# Altium project FLATSAT BCR.PrjPcb
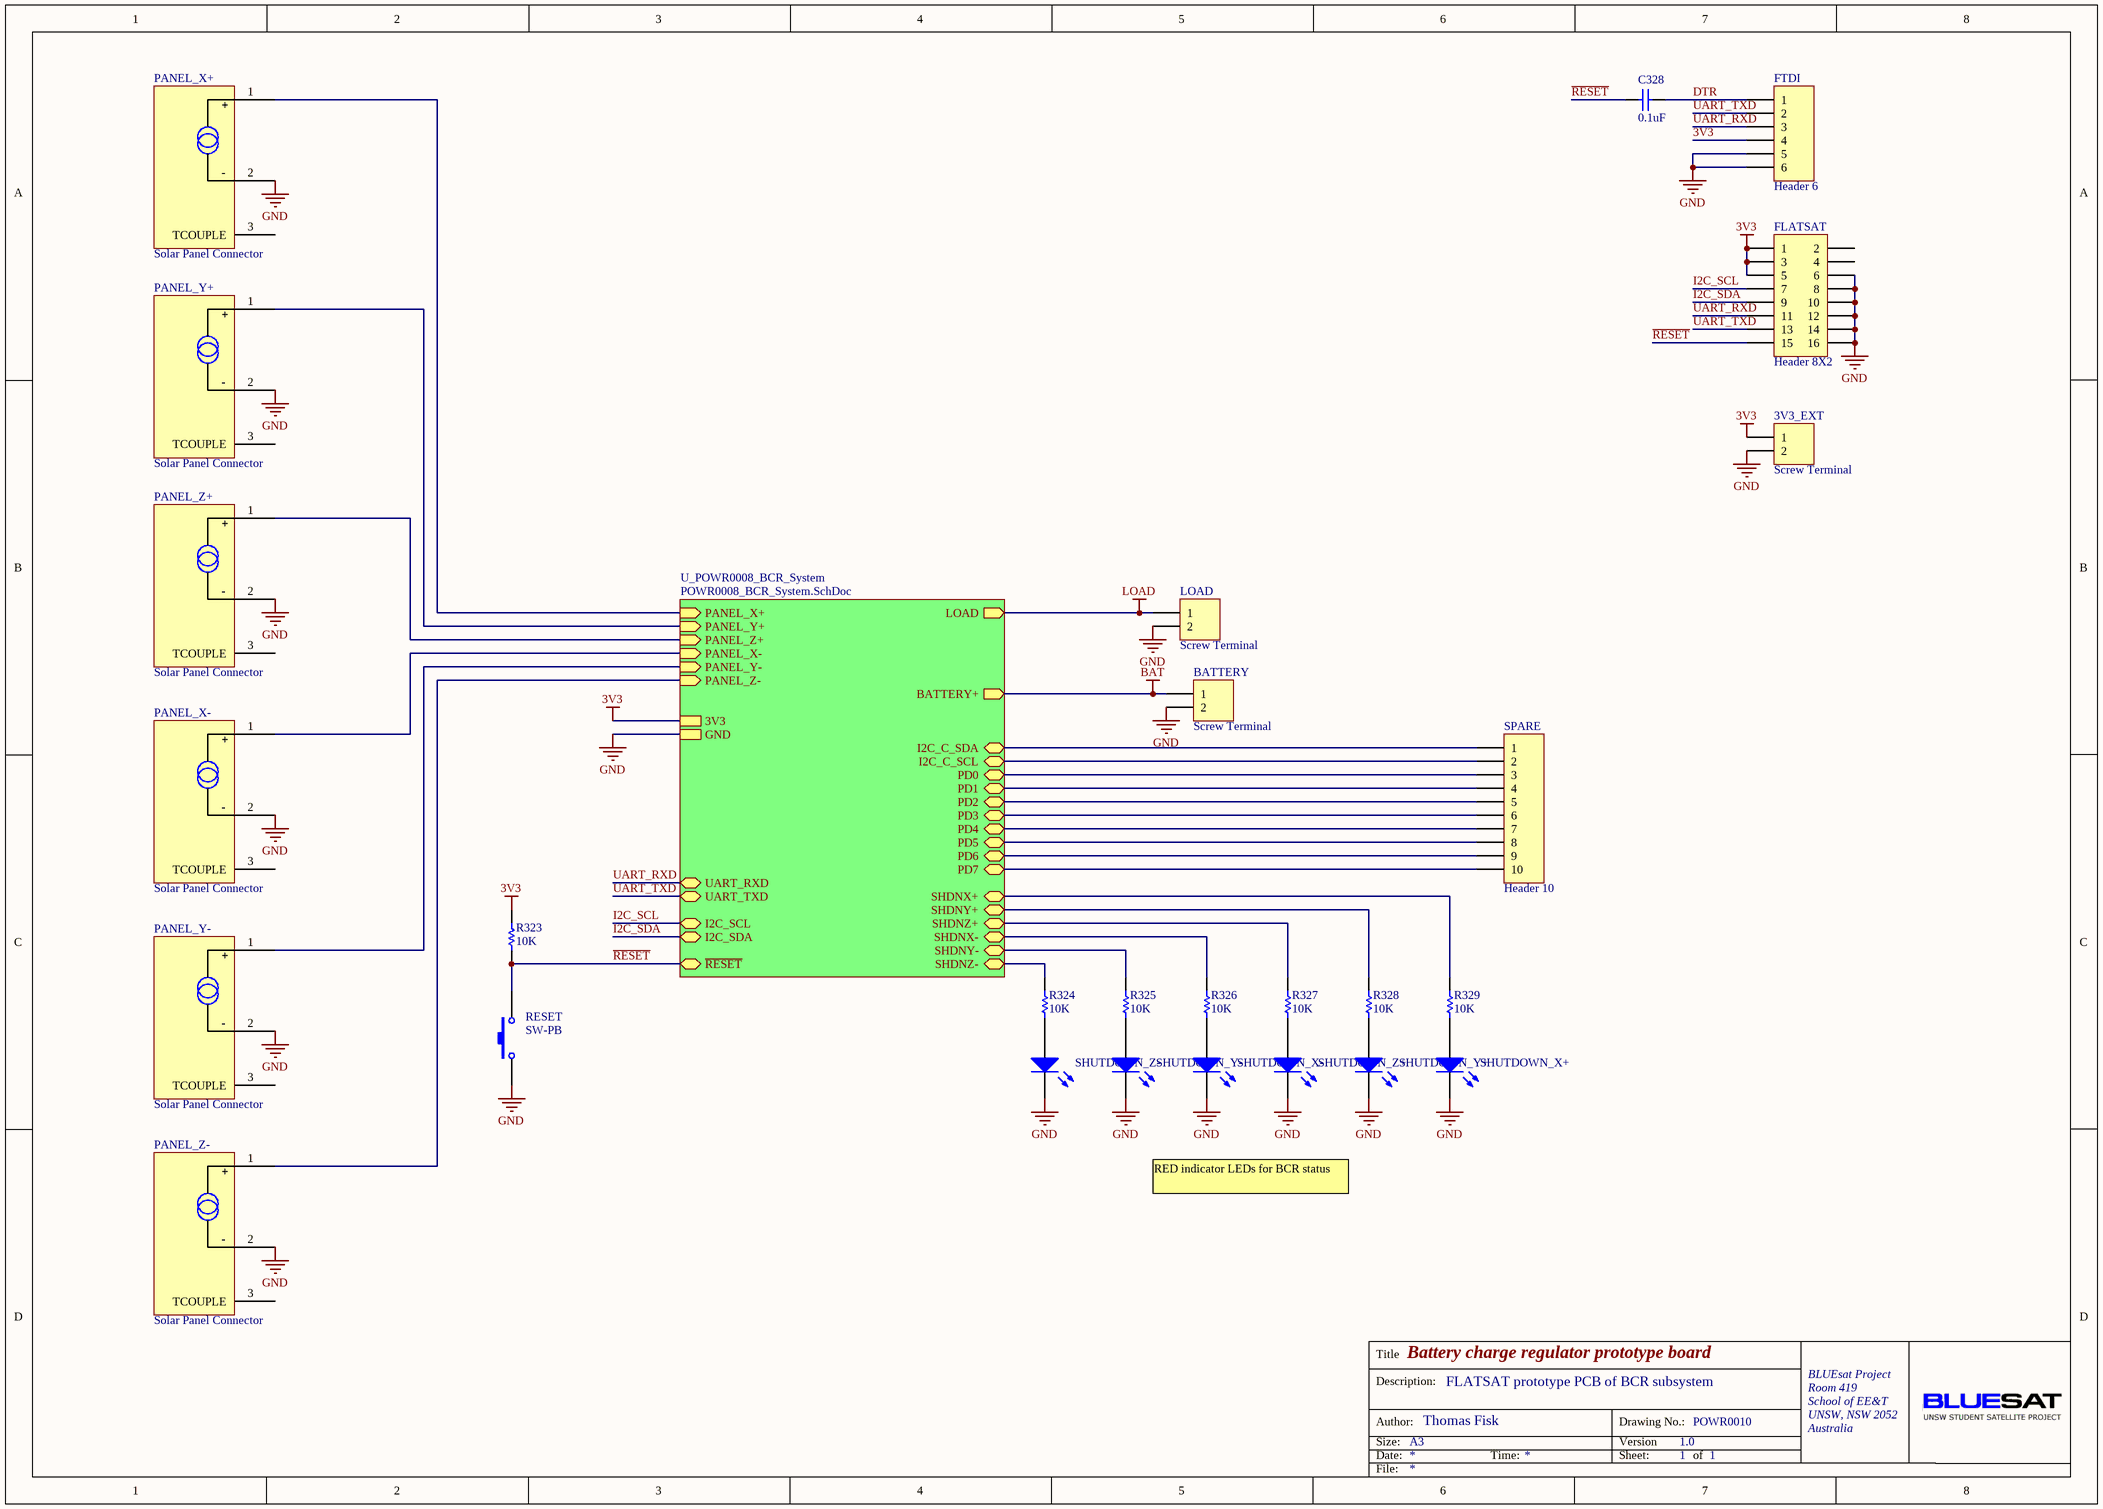
[diagram p0: POWR0010_BCR_TESTBOARD.SchDoc]
3 sheets, 174 parts. Net scope: strictly hierarchical (ports join the sheet entries above them; power ports are local).
Board file: POWR0011_BCR_PROTOTYPE.PcbDoc
Sheets:
  POWR0010_BCR_TESTBOARD.SchDoc
    U_POWR0008_BCR_System = POWR0008_BCR_System.SchDoc
      X+ = POWR0001_BCR_LT1513.SchDoc
      Y+ = POWR0001_BCR_LT1513.SchDoc
      Z+ = POWR0001_BCR_LT1513.SchDoc
      X- = POWR0001_BCR_LT1513.SchDoc
      Y- = POWR0001_BCR_LT1513.SchDoc

## Sheet POWR0010_BCR_TESTBOARD.SchDoc: Battery charge regulator prototype board
size A3; Author: T. FISK; Engineer: Thomas Fisk; Organization: BLUEsat Project; Address1: Room 419; Address2: School of EE&T; Address3: UNSW, NSW 2052; Address4: Australia; DocumentNumber: POWR0010; SheetNumber: 1; SheetTotal: 1; Description: FLATSAT prototype PCB of BCR subsystem; Version: 1.0; PageSetup: Record=PageOptions|CenterHorizontal=True|CenterVertical=True|PrintScale=0.71|XCorrection=1.00|YCorrection=1.00|PrintKind=1|BorderSize=5000000|LeftOffset=0|BottomOffset=0|Orientation=2|PaperLength=1000|PaperWidth=1000|Scale=100|PaperSource=7|PrintQuality=1200|MediaType=1|DitherType=10|PaperKind=A4|PrintScaleMode=1

### Parts
(Parts that share a designator on the sheet are numbered #1, #2 ... from top to bottom, then left to right.)
3V3_EXT  Screw Terminal  [SCREW2]
BATTERY  Screw Terminal  [SCREW2]
C328#1  value 0.1uF  [CAPC2012M]  (hidden comment: Cap)
FLATSAT  Header 8X2  [HDR2X8]
FTDI  Header 6  [HDR1X6]
LOAD  Screw Terminal  [SCREW2]
PANEL_X+  Solar Panel Connector  [SCREW2]
PANEL_X-  Solar Panel Connector  [SCREW2]
PANEL_Y+  Solar Panel Connector  [SCREW2]
PANEL_Y-  Solar Panel Connector  [SCREW2]
PANEL_Z+  Solar Panel Connector  [SCREW2]
PANEL_Z-  Solar Panel Connector  [SCREW2]
R323  value 10K  [RESC2012M]  (hidden comment: Res1)
R324  value 10K  [RESC2012M]  (hidden comment: Res1)
R325  value 10K  [RESC2012M]  (hidden comment: Res1)
R326  value 10K  [RESC2012M]  (hidden comment: Res1)
R327  value 10K  [RESC2012M]  (hidden comment: Res1)
R328  value 10K  [RESC2012M]  (hidden comment: Res1)
R329  value 10K  [RESC2012M]  (hidden comment: Res1)
RESET  SW-PB  [RESET SWITCH]
SHUTDOWN_X+  8V0_RX2  [6-0805_M]  (value not drawn)
SHUTDOWN_X-  VVAR_TX1  [6-0805_M]  (value not drawn)
SHUTDOWN_Y+  VVAR_TX1  [6-0805_M]  (value not drawn)
SHUTDOWN_Y-  8V0_RX2  [6-0805_M]  (value not drawn)
SHUTDOWN_Z+  8V0_RX2  [6-0805_M]  (value not drawn)
SHUTDOWN_Z-  VVAR_TX1  [6-0805_M]  (value not drawn)
SPARE  Header 10  [HDR1X10]

### Sub-sheets
U_POWR0008_BCR_System = POWR0008_BCR_System.SchDoc: PANEL_X+ (in), PANEL_Y+ (in), PANEL_Z+ (in), PANEL_X- (in), PANEL_Y- (in), PANEL_Z- (in), UART_RXD (bidir), UART_TXD (bidir), LOAD (out), BATTERY+ (out), 3V3, GND, SHDNX+ (bidir), SHDNY+ (bidir), SHDNZ+ (bidir), SHDNX- (bidir), SHDNY- (bidir), SHDNZ- (bidir), I2C_SCL (bidir), I2C_SDA (bidir), ~{RESET} (bidir), PD0 (bidir), PD1 (bidir), PD2 (bidir), PD3 (bidir), PD4 (bidir), PD5 (bidir), PD6 (bidir), PD7 (bidir), I2C_C_SDA (bidir), I2C_C_SCL (bidir)

### Nets
3V3: 3V3_EXT.1 FLATSAT.1 FLATSAT.3 FLATSAT.5 FTDI.4 R323.1 ; sheet U_POWR0008_BCR_System/3V3
BAT: BATTERY.1 ; sheet U_POWR0008_BCR_System/BATTERY+
GND: 3V3_EXT.2 BATTERY.2 FLATSAT.6 FLATSAT.8 FLATSAT.10 FLATSAT.12 FLATSAT.14 FLATSAT.16 FTDI.5 FTDI.6 LOAD.2 PANEL_X+.2(PANEL-) PANEL_X-.2(PANEL-) PANEL_Y+.2(PANEL-) PANEL_Y-.2(PANEL-) PANEL_Z+.2(PANEL-) PANEL_Z-.2(PANEL-) RESET.1 SHUTDOWN_X+.2(K) SHUTDOWN_X-.2(K) SHUTDOWN_Y+.2(K) SHUTDOWN_Y-.2(K) SHUTDOWN_Z+.2(K) SHUTDOWN_Z-.2(K) ; sheet U_POWR0008_BCR_System/GND
LOAD: LOAD.1 ; sheet U_POWR0008_BCR_System/LOAD
DTR: C328#1.1 FTDI.1
I2C_SCL: FLATSAT.7 ; sheet U_POWR0008_BCR_System/I2C_SCL
I2C_SDA: FLATSAT.9 ; sheet U_POWR0008_BCR_System/I2C_SDA
~{RESET}: C328#1.2 FLATSAT.15 R323.2 RESET.2 ; sheet U_POWR0008_BCR_System/~{RESET}  [project net PDI_CLK]
UART_RXD: FLATSAT.11 FTDI.3 ; sheet U_POWR0008_BCR_System/UART_RXD
UART_TXD: FLATSAT.13 FTDI.2 ; sheet U_POWR0008_BCR_System/UART_TXD
NetPANEL_X+_1: PANEL_X+.1(PANEL+) ; sheet U_POWR0008_BCR_System/PANEL_X+
NetPANEL_X-_1: PANEL_X-.1(PANEL+) ; sheet U_POWR0008_BCR_System/PANEL_X-
NetPANEL_Y+_1: PANEL_Y+.1(PANEL+) ; sheet U_POWR0008_BCR_System/PANEL_Y+
NetPANEL_Y-_1: PANEL_Y-.1(PANEL+) ; sheet U_POWR0008_BCR_System/PANEL_Y-
NetPANEL_Z+_1: PANEL_Z+.1(PANEL+) ; sheet U_POWR0008_BCR_System/PANEL_Z+
NetPANEL_Z-_1: PANEL_Z-.1(PANEL+) ; sheet U_POWR0008_BCR_System/PANEL_Z-
NetR324_1: R324.1 SHUTDOWN_Z-.1(A)
NetR324_2: R324.2 ; sheet U_POWR0008_BCR_System/SHDNZ-
NetR325_1: R325.1 SHUTDOWN_Y-.1(A)
NetR325_2: R325.2 ; sheet U_POWR0008_BCR_System/SHDNY-
NetR326_1: R326.1 SHUTDOWN_X-.1(A)
NetR326_2: R326.2 ; sheet U_POWR0008_BCR_System/SHDNX-
NetR327_1: R327.1 SHUTDOWN_Z+.1(A)
NetR327_2: R327.2 ; sheet U_POWR0008_BCR_System/SHDNZ+
NetR328_1: R328.1 SHUTDOWN_Y+.1(A)
NetR328_2: R328.2 ; sheet U_POWR0008_BCR_System/SHDNY+
NetR329_1: R329.1 SHUTDOWN_X+.1(A)
NetR329_2: R329.2 ; sheet U_POWR0008_BCR_System/SHDNX+
NetSPARE_1: SPARE.1 ; sheet U_POWR0008_BCR_System/I2C_C_SDA
NetSPARE_2: SPARE.2 ; sheet U_POWR0008_BCR_System/I2C_C_SCL
NetSPARE_3: SPARE.3 ; sheet U_POWR0008_BCR_System/PD0
NetSPARE_4: SPARE.4 ; sheet U_POWR0008_BCR_System/PD1
NetSPARE_5: SPARE.5 ; sheet U_POWR0008_BCR_System/PD2
NetSPARE_6: SPARE.6 ; sheet U_POWR0008_BCR_System/PD3
NetSPARE_7: SPARE.7 ; sheet U_POWR0008_BCR_System/PD4
NetSPARE_8: SPARE.8 ; sheet U_POWR0008_BCR_System/PD5
NetSPARE_9: SPARE.9 ; sheet U_POWR0008_BCR_System/PD6
NetSPARE_10: SPARE.10 ; sheet U_POWR0008_BCR_System/PD7

Not connected (* = marked no-connect by the designer): FLATSAT 2 4; PANEL_X+ 3(TCOUPLE); PANEL_X- 3(TCOUPLE); PANEL_Y+ 3(TCOUPLE); PANEL_Y- 3(TCOUPLE); PANEL_Z+ 3(TCOUPLE); PANEL_Z- 3(TCOUPLE)

### Notes on the sheet
- RED indicator LEDs for BCR status
- Title
- Description:
- Size:
- Author:
- Date:
- A3
- Time:
- Version
- Sheet:
- Drawing No.:
- of
- File:
- (in symbol Solar Panel Connector) +; -

### Library data of the parts
3V3_EXT BATTERY LOAD = Header 2: Header, 2-Pin; LatestRevisionDate: 17-Jul-2002; LatestRevisionNote: Re-released for DXP Platform.; Publisher: Altium Limited
C328#1 = Cap: Capacitor; Published: 8-Jun-2000; LatestRevisionDate: 17-Jul-2002; LatestRevisionNote: Re-released for DXP Platform.; PackageReference: RAD-0.3; Publisher: Altium Limited; PackageDescription: Radial Cap, Thru-Hole; 2 Leads; 0.3 in Pin Spacing; Supplier 1: Farnell; Supplier 2: Farnell; Supplier Part Number 2: 1759265
FLATSAT = Header 8X2: Header, 8-Pin, Dual row; LatestRevisionDate: 17-Jul-2002; LatestRevisionNote: Re-released for DXP Platform.; Publisher: Altium Limited
FTDI = Header 6: Header, 6-Pin; LatestRevisionDate: 17-Jul-2002; LatestRevisionNote: Re-released for DXP Platform.; Publisher: Altium Limited
R323-R329 = Res1: Resistor; Published: 8-Jun-2000; LatestRevisionDate: 17-Jul-2002; LatestRevisionNote: Re-released for DXP Platform.; PackageReference: AXIAL-0.3; Publisher: Altium Limited; PackageDescription: Axial Device, Thru-Hole; 2 Leads; 0.3 in Pin Spacing; Supplier 1: Farnell
RESET = SW-PB: Switch; Published: 24-Mar-1999; LatestRevisionDate: 17-Jul-2002; LatestRevisionNote: Re-released for DXP Platform.; PackageReference: SPST-2; Publisher: Altium Limited; PackageDescription: Switch; 2 Leads
SHUTDOWN_X+ SHUTDOWN_X- SHUTDOWN_Y+ SHUTDOWN_Y- SHUTDOWN_Z+ SHUTDOWN_Z- = LED0: Typical INFRARED GaAs LED; Published: 8-Jun-2000; LatestRevisionDate: 08-Jul-2005; LatestRevisionNote: Mech Layer 1 removed.; PackageReference: LED-0; Publisher: Altium Limited; PackageDescription: LED; 2 Leads; ClassName: LED_BANK_PWR
SPARE = Header 10: Header, 10-Pin; LatestRevisionDate: 17-Jul-2002; LatestRevisionNote: Re-released for DXP Platform.; Publisher: Altium Limited

## Sheet POWR0008_BCR_System.SchDoc: BLUEsat solar battery charge regulator subystem
size A3; Engineer: Thomas Fisk; Organization: BLUEsat Project; Address1: Room 419; Address2: School of EE&T; Address3: UNSW, NSW 2052; Address4: Australia; DocumentNumber: POWR0008; SheetNumber: 1; SheetTotal: 1; Description: Solar battery charge regulator subsystem.; Version: 2.6; PageSetup: Record=PageOptions|CenterHorizontal=True|CenterVertical=True|PrintScale=0.71|XCorrection=1.00|YCorrection=1.00|PrintKind=1|BorderSize=5000000|LeftOffset=0|BottomOffset=0|Orientation=2|PaperLength=2970|PaperWidth=2100|Scale=100|PaperSource=7|PrintQuality=1200|MediaType=1|DitherType=10|PaperKind=A4|PrintScaleMode=1
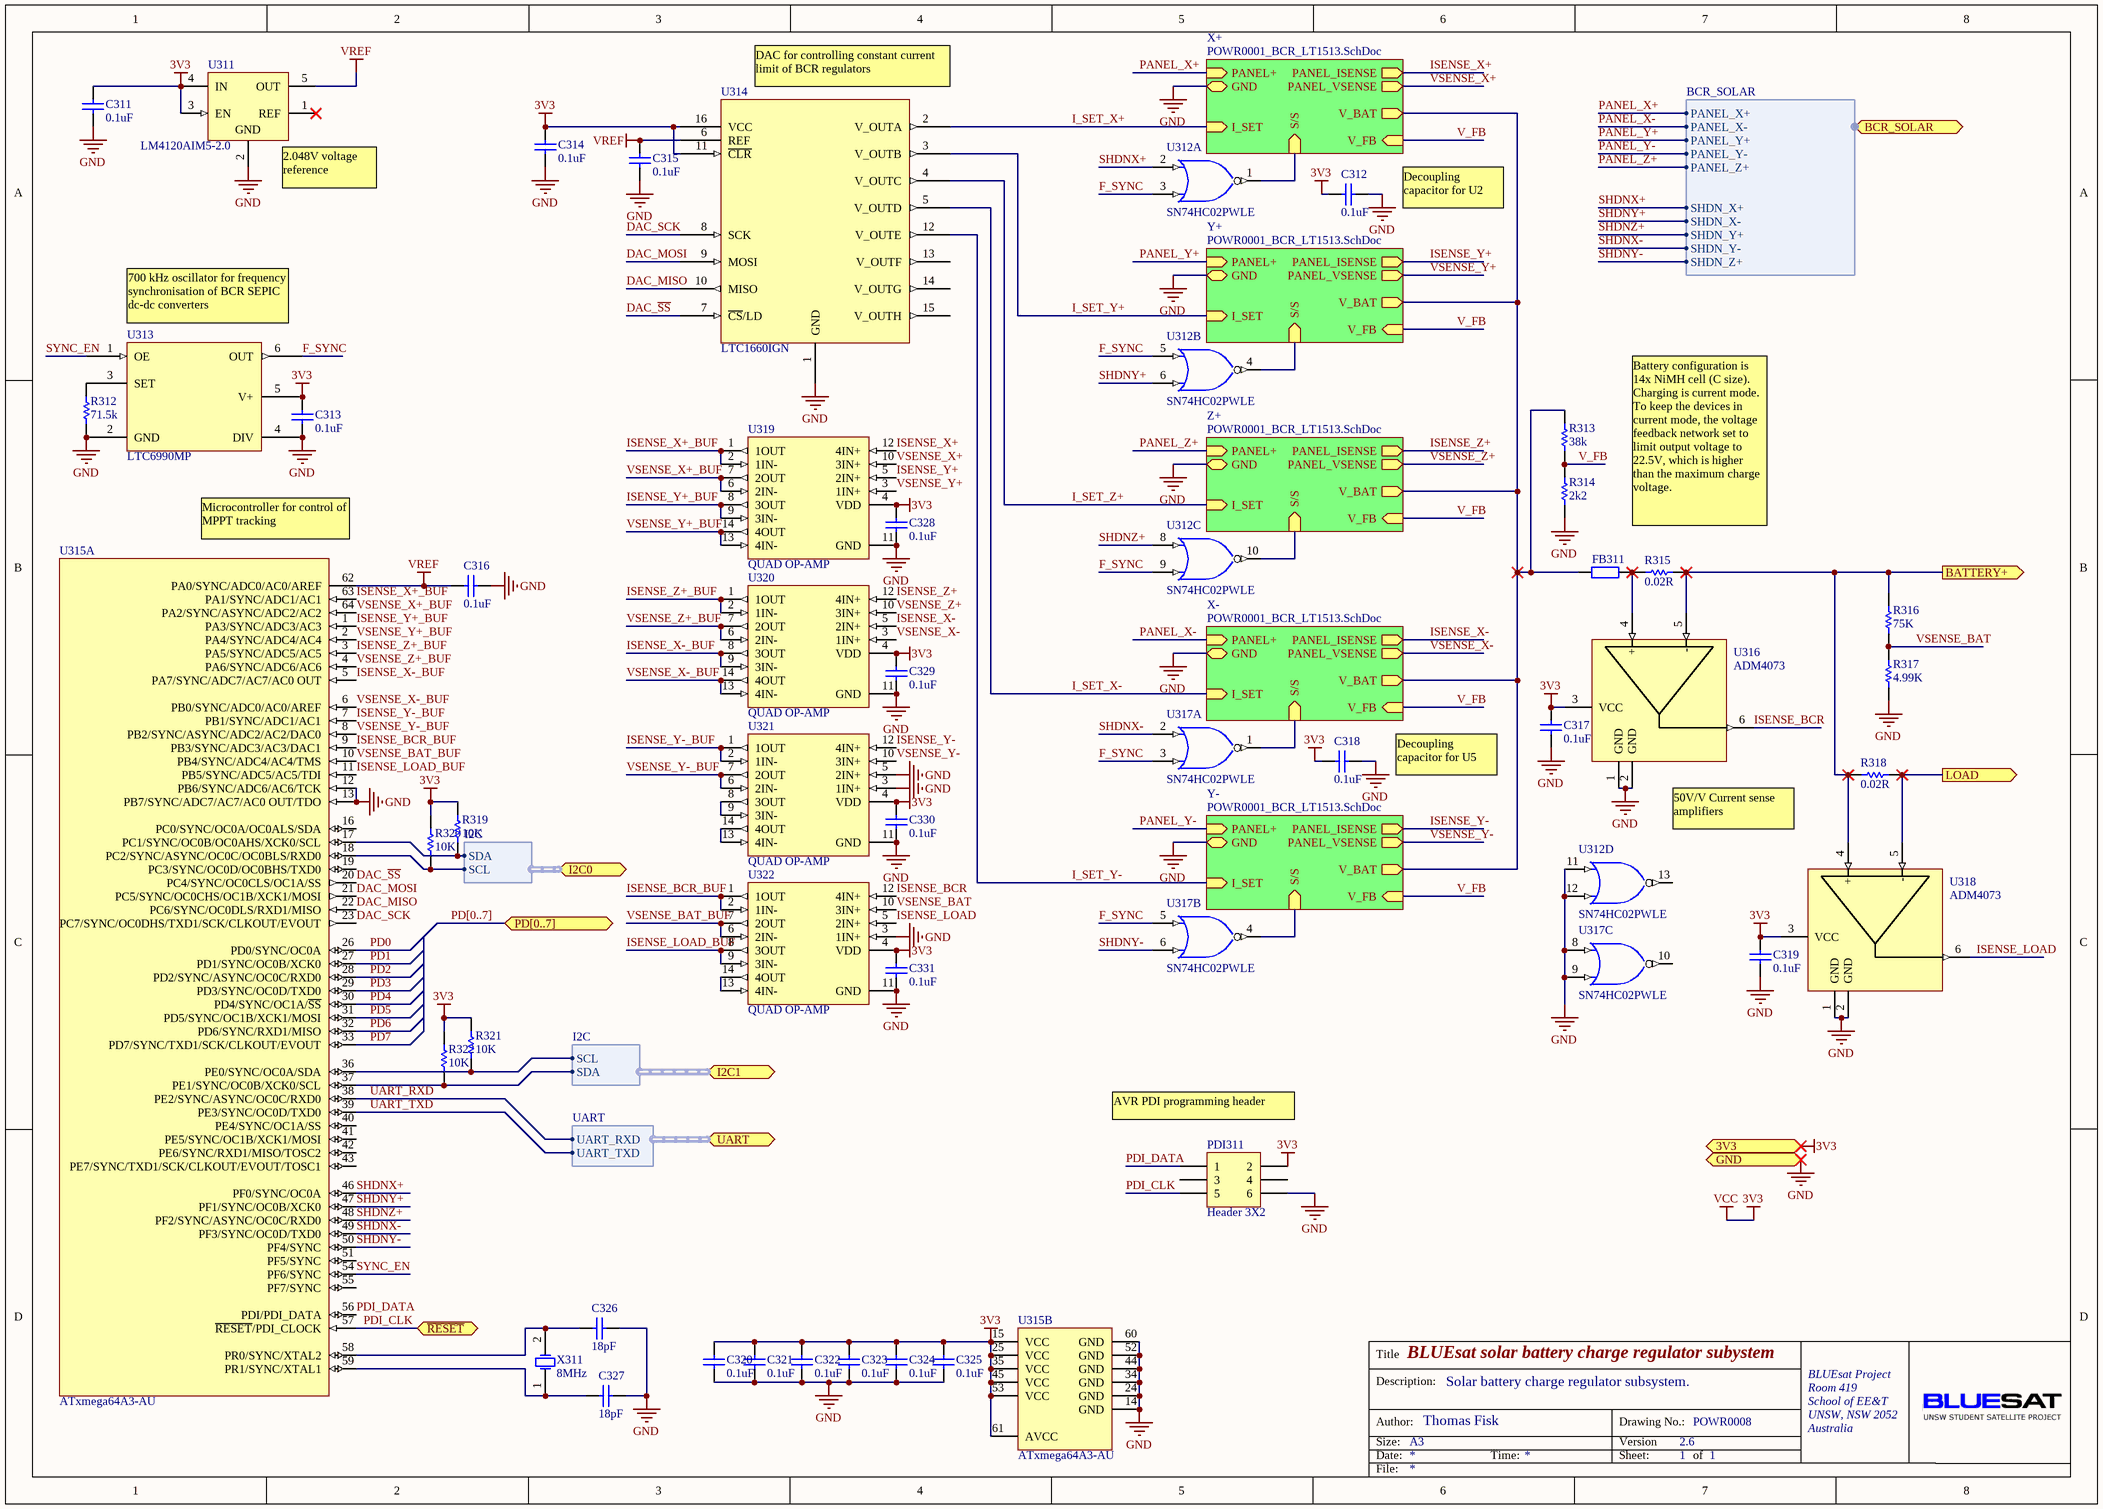
[diagram p1: POWR0008_BCR_System.SchDoc]

### Parts
(Parts that share a designator on the sheet are numbered #1, #2 ... from top to bottom, then left to right.)
C311  value 0.1uF  [CAPC2012M]  (hidden comment: Cap)
C312  value 0.1uF  [CAPC2012M]  (hidden comment: Cap)
C313  value 0.1uF  [CAPC2012M]  (hidden comment: Cap)
C314  value 0.1uF  [CAPC2012M]  (hidden comment: Cap)
C315  value 0.1uF  [CAPC2012M]  (hidden comment: Cap)
C316  value 0.1uF  [CAPC2012M]  (hidden comment: Cap)
C317  value 0.1uF  [CAPC2012M]  (hidden comment: Cap)
C318  value 0.1uF  [CAPC2012M]  (hidden comment: Cap)
C319  value 0.1uF  [CAPC2012M]  (hidden comment: Cap)
C320  value 0.1uF  [CAPC2012M]  (hidden comment: Cap)
C321  value 0.1uF  [CAPC2012M]  (hidden comment: Cap)
C322  value 0.1uF  [CAPC2012M]  (hidden comment: Cap)
C323  value 0.1uF  [CAPC2012M]  (hidden comment: Cap)
C324  value 0.1uF  [CAPC2012M]  (hidden comment: Cap)
C325  value 0.1uF  [CAPC2012M]  (hidden comment: Cap)
C326  value 18pF  [CAPC2012M]  (hidden comment: Cap)
C327  value 18pF  [CAPC2012M]  (hidden comment: Cap)
C328#2  value 0.1uF  [CAPC2012M]  (hidden comment: Cap)
C329  value 0.1uF  [CAPC2012M]  (hidden comment: Cap)
C330  value 0.1uF  [CAPC2012M]  (hidden comment: Cap)
C331  value 0.1uF  [CAPC2012M]  (hidden comment: Cap)
FB311  Res2  [RESC2012M]  (value not drawn)
PDI311  Header 3X2  [HDR2X3]
R312  value 71.5k  [RESC2012M]  (hidden comment: Res1)
R313  value 38k  [RESC2012M]  (hidden comment: Res1)
R314  value 2k2  [RESC2012M]  (hidden comment: Res1)
R315  value 0.02R  [RESC2012M]  (hidden comment: 0805 Resistor)
R316  value 75K  [RESC2012M]  (hidden comment: Res1)
R317  value 4.99K  [RESC2012M]  (hidden comment: Res1)
R318  value 0.02R  [RESC2012M]  (hidden comment: 0805 Resistor)
R319  value 10K  [RESC2012M]  (hidden comment: Res1)
R320  value 10K  [RESC2012M]  (hidden comment: Res1)
R321  value 10K  [RESC2012M]  (hidden comment: Res1)
R322  value 10K  [RESC2012M]  (hidden comment: Res1)
U311  LM4120AIM5-2.0  [MF05A_N]
U312  SN74HC02PWLE  [TSOP65P640-14AN]  (parts A,B,C,D of 4)
U313  LTC6990MP  [SOT26A-6L]
U314  LTC1660IGN  [SOP635P600-16N]
U315  ATxmega64A3-AU  [64A_N]  (parts A,B of 2)
U316  ADM4073  [SOT26A-6N]
U317  SN74HC02PWLE  [TSOP65P640-14AN]  (parts A,B,C of 4)
U318  ADM4073  [SOT26A-6N]
U319  QUAD OP-AMP  [TSOP65P640-14AN]
U320  QUAD OP-AMP  [TSOP65P640-14AN]
U321  QUAD OP-AMP  [TSOP65P640-14AN]
U322  QUAD OP-AMP  [TSOP65P640-14AN]
X311  8MHz  [HC49 - No border]

### Sub-sheets
X+ = POWR0001_BCR_LT1513.SchDoc: I_SET (in), V_BAT, S/S (in), V_FB (in), PANEL_VSENSE (out), PANEL_ISENSE (out), PANEL+ (in), GND
X- = POWR0001_BCR_LT1513.SchDoc: I_SET (in), V_BAT, S/S (in), V_FB (in), PANEL_VSENSE (out), PANEL_ISENSE (out), PANEL+ (in), GND
Y+ = POWR0001_BCR_LT1513.SchDoc: I_SET (in), V_BAT, S/S (in), V_FB (in), PANEL_VSENSE (out), PANEL_ISENSE (out), PANEL+ (in), GND
Y- = POWR0001_BCR_LT1513.SchDoc: I_SET (in), V_BAT, S/S (in), V_FB (in), PANEL_VSENSE (out), PANEL_ISENSE (out), PANEL+ (in), GND
Z+ = POWR0001_BCR_LT1513.SchDoc: I_SET (in), V_BAT, S/S (in), V_FB (in), PANEL_VSENSE (out), PANEL_ISENSE (out), PANEL+ (in), GND

### Ports
3V3, BATTERY+ (out), BCR_SOLAR (harness BCR_SOLAR), GND, I2C0 (harness I2C), I2C1 (harness I2C), LOAD (out), PD[0..7] (bidir), UART (harness UART), ~{RESET} (bidir)

### Harnesses
BCR_SOLAR: PANEL_X+, PANEL_X-, PANEL_Y+, PANEL_Y-, PANEL_Z+, SHDN_X+, SHDN_X-, SHDN_Y+, SHDN_Y-, SHDN_Z+
I2C: SCL, SDA
UART: UART_TXD, UART_RXD

### Nets
3V3: C311.2 C312.2 C313.1 C314.2 C317.1 C318.2 C319.1 C320.2 C321.2 C322.2 C323.2 C324.2 C325.2 C328#2.1 C329.1 C330.1 C331.1 PDI311.2 R319.1 R320.1 R321.1 R322.1 U311.3(EN) U311.4(IN) U312.14(VCC) U313.5(V+) U314.11(~{CLR}) U314.16(VCC) U315.15(VCC) U315.25(VCC) U315.35(VCC) U315.45(VCC) U315.53(VCC) U315.61(AVCC) U316.3(VCC) U317.14(VCC) U318.3(VCC) U319.4(VDD) U320.4(VDD) U321.4(VDD) U322.4(VDD) ; port 3V3  [also labelled VCC]
BAT: R315.2 R316.1 R318.2 U316.5(-) U318.4(+) ; port BATTERY+
GND: C311.1 C312.1 C313.2 C314.1 C315.1 C316.1 C317.2 C318.1 C319.2 C320.1 C321.1 C322.1 C323.1 C324.1 C325.1 C326.2 C327.1 C328#2.2 C329.2 C330.2 C331.2 PDI311.6 R312.1 R314.1 R317.2 U311.2(GND) U312.7(GND) U312.11(A) U312.12(B) U313.2(GND) U313.4(DIV) U314.1(GND) U315.12(PB6/SYNC/ADC6/AC6/TCK) U315.13(PB7/SYNC/ADC7/AC7/AC0_OUT/TDO) U315.14(GND) U315.24(GND) U315.34(GND) U315.44(GND) U315.52(GND) U315.60(GND) U316.1(GND) U316.2(GND) U317.7(GND) U317.8(A) U317.9(B) U318.1(GND) U318.2(GND) U319.11(GND) U320.11(GND) U321.3(1IN+) U321.5(2IN+) U321.11(GND) U322.3(1IN+) U322.11(GND) ; port GND, sheet X+/GND, sheet Y+/GND, sheet Z+/GND, sheet X-/GND, sheet Y-/GND
LOAD: R318.1 U318.5(-) ; port LOAD
VREF: C315.2 C316.2 U311.5(OUT) U314.6(REF) U315.62(PA0/SYNC/ADC0/AC0/AREF)
DAC_MISO: U314.10(MISO) U315.22(PC6/SYNC/OC0DLS/RXD1/MISO)
DAC_MOSI: U314.9(MOSI) U315.21(PC5/SYNC/OC0CHS/OC1B/XCK1/MOSI)
DAC_~{SS}: U314.7(~{CS}/LD) U315.20(PC4/SYNC/OC0CLS/OC1A/SS)
DAC_SCK: U314.8(SCK) U315.23(PC7/SYNC/OC0DHS/TXD1/SCK/CLKOUT/EVOUT)
F_SYNC: U312.3(B) U312.5(A) U312.9(B) U313.6(OUT) U317.3(B) U317.5(A)
I_SET_X+: U314.2(V_OUTA) ; sheet X+/I_SET
I_SET_X-: U314.5(V_OUTD) ; sheet X-/I_SET
I_SET_Y+: U314.3(V_OUTB) ; sheet Y+/I_SET
I_SET_Y-: U314.12(V_OUTE) ; sheet Y-/I_SET
I_SET_Z+: U314.4(V_OUTC) ; sheet Z+/I_SET
ISENSE_BCR: U316.6 U322.12(4IN+)
ISENSE_BCR_BUF: U315.9(PB3/SYNC/ADC3/AC3/DAC1) U322.1(1OUT) U322.2(1IN-)
ISENSE_LOAD: U318.6 U322.5(2IN+)
ISENSE_LOAD_BUF: U315.11(PB5/SYNC/ADC5/AC5/TDI) U322.8(3OUT) U322.9(3IN-)
ISENSE_X+: U319.12(4IN+) ; sheet X+/PANEL_ISENSE
ISENSE_X+_BUF: U315.63(PA1/SYNC/ADC1/AC1) U319.1(1OUT) U319.2(1IN-)
ISENSE_X-: U320.5(2IN+) ; sheet X-/PANEL_ISENSE
ISENSE_X-_BUF: U315.5(PA7/SYNC/ADC7/AC7/AC0_OUT) U320.8(3OUT) U320.9(3IN-)
ISENSE_Y+: U319.5(2IN+) ; sheet Y+/PANEL_ISENSE
ISENSE_Y+_BUF: U315.1(PA3/SYNC/ADC3/AC3) U319.8(3OUT) U319.9(3IN-)
ISENSE_Y-: U321.12(4IN+) ; sheet Y-/PANEL_ISENSE
ISENSE_Y-_BUF: U315.7(PB1/SYNC/ADC1/AC1) U321.1(1OUT) U321.2(1IN-)
ISENSE_Z+: U320.12(4IN+) ; sheet Z+/PANEL_ISENSE
ISENSE_Z+_BUF: U315.3(PA5/SYNC/ADC5/AC5) U320.1(1OUT) U320.2(1IN-)
PANEL_X+: sheet X+/PANEL+, port BCR_SOLAR.PANEL_X+
PANEL_X-: sheet X-/PANEL+, port BCR_SOLAR.PANEL_X-
PANEL_Y+: sheet Y+/PANEL+, port BCR_SOLAR.PANEL_Y+
PANEL_Y-: sheet Y-/PANEL+, port BCR_SOLAR.PANEL_Y-
PANEL_Z+: sheet Z+/PANEL+, port BCR_SOLAR.PANEL_Z+
PD0: U315.26(PD0/SYNC/OC0A)
PD1: U315.27(PD1/SYNC/OC0B/XCK0)
PD2: U315.28(PD2/SYNC/ASYNC/OC0C/RXD0)
PD3: U315.29(PD3/SYNC/OC0D/TXD0)
PD4: U315.30(PD4/SYNC/OC1A/~{SS})
PD5: U315.31(PD5/SYNC/OC1B/XCK1/MOSI)
PD6: U315.32(PD6/SYNC/RXD1/MISO)
PD7: U315.33(PD7/SYNC/TXD1/SCK/CLKOUT/EVOUT)
PDI_CLK: PDI311.5 U315.57(~{RESET}/PDI_CLOCK) ; port ~{RESET}
PDI_DATA: PDI311.1 U315.56(PDI/PDI_DATA)
SHDNX+: U312.2(A) U315.46(PF0/SYNC/OC0A) ; port BCR_SOLAR.SHDN_X+
SHDNX-: U315.49(PF3/SYNC/OC0D/TXD0) U317.2(A) ; port BCR_SOLAR.SHDN_Y-
SHDNY+: U312.6(B) U315.47(PF1/SYNC/OC0B/XCK0) ; port BCR_SOLAR.SHDN_X-
SHDNY-: U315.50(PF4/SYNC) U317.6(B) ; port BCR_SOLAR.SHDN_Z+
SHDNZ+: U312.8(A) U315.48(PF2/SYNC/ASYNC/OC0C/RXD0) ; port BCR_SOLAR.SHDN_Y+
SYNC_EN: U313.1(OE) U315.54(PF6/SYNC)
UART_RXD: U315.38(PE2/SYNC/ASYNC/OC0C/RXD0) ; port UART.UART_RXD
UART_TXD: U315.39(PE3/SYNC/OC0D/TXD0) ; port UART.UART_TXD
V_FB: R313.1 R314.2 ; sheet X+/V_FB, sheet Y+/V_FB, sheet Z+/V_FB, sheet X-/V_FB, sheet Y-/V_FB
VSENSE_BAT: R316.2 R317.1 U322.10(3IN+)
VSENSE_BAT_BUF: U315.10(PB4/SYNC/ADC4/AC4/TMS) U322.6(2IN-) U322.7(2OUT)
VSENSE_X+: U319.10(3IN+) ; sheet X+/PANEL_VSENSE
VSENSE_X+_BUF: U315.64(PA2/SYNC/ASYNC/ADC2/AC2) U319.6(2IN-) U319.7(2OUT)
VSENSE_X-: U320.3(1IN+) ; sheet X-/PANEL_VSENSE
VSENSE_X-_BUF: U315.6(PB0/SYNC/ADC0/AC0/AREF) U320.13(4IN-) U320.14(4OUT)
VSENSE_Y+: U319.3(1IN+) ; sheet Y+/PANEL_VSENSE
VSENSE_Y+_BUF: U315.2(PA4/SYNC/ADC4/AC4) U319.13(4IN-) U319.14(4OUT)
VSENSE_Y-: U321.10(3IN+) ; sheet Y-/PANEL_VSENSE
VSENSE_Y-_BUF: U315.8(PB2/SYNC/ASYNC/ADC2/AC2/DAC0) U321.6(2IN-) U321.7(2OUT)
VSENSE_Z+: U320.10(3IN+) ; sheet Z+/PANEL_VSENSE
VSENSE_Z+_BUF: U315.4(PA6/SYNC/ADC6/AC6) U320.6(2IN-) U320.7(2OUT)
NetC6_X+_1: FB311.1 R313.2 ; sheet X+/V_BAT, sheet Y+/V_BAT, sheet Z+/V_BAT, sheet X-/V_BAT, sheet Y-/V_BAT
NetC326_1: C326.1 U315.58(PR0/SYNC/XTAL2) X311.2(OSC2)
NetC327_2: C327.2 U315.59(PR1/SYNC/XTAL1) X311.1(OSC1)
NetFB311_2: FB311.2 R315.1 U316.4(+)
NetR312_2: R312.2 U313.3(SET)
NetR319_2: R319.2 U315.17(PC1/SYNC/OC0B/OC0AHS/XCK0/SCL) ; port I2C0.SDA
NetR320_2: R320.2 U315.18(PC2/SYNC/ASYNC/OC0C/OC0BLS/RXD0) ; port I2C0.SCL
NetR321_2: R321.2 U315.36(PE0/SYNC/OC0A/SDA) ; port I2C1.SCL
NetR322_2: R322.2 U315.37(PE1/SYNC/OC0B/XCK0/SCL) ; port I2C1.SDA
NetU1_X+_6: U312.1(Y) ; sheet X+/S/S
NetU1_X-_6: U317.1(Y) ; sheet X-/S/S
NetU1_Y+_6: U312.4(Y) ; sheet Y+/S/S
NetU1_Z+_6: U312.10(Y) ; sheet Z+/S/S
NetU1_Z-_6: U317.4(Y) ; sheet Y-/S/S
NetU321_8: U321.8(3OUT) U321.9(3IN-)
NetU321_13: U321.13(4IN-) U321.14(4OUT)
NetU322_13: U322.13(4IN-) U322.14(4OUT)

Not connected (* = marked no-connect by the designer): PDI311 3 4; U311 1(REF)*; U312 13(Y); U314 13(V_OUTF) 14(V_OUTG) 15(V_OUTH); U315 16(PC0/SYNC/OC0A/OC0ALS/SDA) 19(PC3/SYNC/OC0D/OC0BHS/TXD0) 40(PE4/SYNC/OC1A/SS) 41(PE5/SYNC/OC1B/XCK1/MOSI) 42(PE6/SYNC/RXD1/MISO/TOSC2) 43(PE7/SYNC/TXD1/SCK/CLKOUT/EVOUT/TOSC1) 51(PF5/SYNC) 55(PF7/SYNC); U317 10(Y)

### Buses and harness runs
bus PD[0..7] = port PD[0..7]

### Notes on the sheet
- (near U314) DAC for controlling constant current limit of BCR regulators
- (near U311) 2.048V voltage reference
- (near C312) Decoupling capacitor for U2
- (near U313) 700 kHz oscillator for frequency synchronisation of BCR SEPIC dc-dc converters
- Microcontroller for control of MPPT tracking
- Battery configuration is 14x NiMH cell (C size). Charging is current mode. To keep the devices in current mode, the voltage feedback network set to limit output voltage to 22.5V, which is higher than the maximum charge voltage.
- Decoupling capacitor for U5
- 50V/V Current sense amplifiers
- (near PDI311) AVR PDI programming header
- Title
- Description:
- Size:
- Author:
- Date:
- A3
- Time:
- Version
- Sheet:
- Drawing No.:
- of
- File:

### Library data of the parts
C311-C327 C328#2 C329-C331 = Cap: Capacitor; Published: 8-Jun-2000; LatestRevisionDate: 17-Jul-2002; LatestRevisionNote: Re-released for DXP Platform.; PackageReference: RAD-0.3; Publisher: Altium Limited; PackageDescription: Radial Cap, Thru-Hole; 2 Leads; 0.3 in Pin Spacing; Supplier 1: Farnell; Supplier 2: Farnell; Supplier Part Number 2: 1759265
FB311 = Res2: Resistor; Value: 1K; Published: 8-Jun-2000; LatestRevisionDate: 17-Jul-2002; LatestRevisionNote: Re-released for DXP Platform.; PackageReference: AXIAL-0.4; Publisher: Altium Limited; PackageDescription: Axial Device, Thru-Hole; 2 Leads; 0.4 in Pin Spacing
PDI311 = Header 3X2: Header, 3-Pin, Dual row; LatestRevisionDate: 17-Jul-2002; LatestRevisionNote: Re-released for DXP Platform.; Publisher: Altium Limited
R312-R322 = Res1: Resistor; Published: 8-Jun-2000; LatestRevisionDate: 17-Jul-2002; LatestRevisionNote: Re-released for DXP Platform.; PackageReference: AXIAL-0.3; Publisher: Altium Limited; PackageDescription: Axial Device, Thru-Hole; 2 Leads; 0.3 in Pin Spacing; Supplier 1: Farnell
U311 = LM4120AIM5-2.0: Precision Micropower Low Dropout Voltage Reference; Manufacturer: National Semiconductor; CompType: Voltage Reference IC; PackageTopMarking: R14A*XTT; PowerWise: Y; Published: 4-Dec-2008; DatasheetVersion: Mar-2005; PackageVersion: revD, Aug-2008; PackageReference: MF05A; Publisher: Altium Limited; PackageDescription: Molded SOT-23, .115 x .063 x .040 in Body, 5 Lead, .0375 in Pitch; PartNumber: LM4120AIM5-2.0; RoHS: O; PinCount: 5; DigiKeyPartNumber: LM4120AIM5-2.0CT-ND; ComponentLink1Description: LM4120 Datasheet; ComponentLink1URL: http://www.national.com/ds/LM/LM4120.pdf; ComponentLink2Description: LM4120 Web Page; ComponentLink2URL: http://www.national.com/pf/LM/LM4120.html; ComponentLink3Description: MF05A Package Page; ComponentLink3URL: http://www.national.com/packaging/folders/mf05a.html
U312 U317 = SN74HC02PWLE: Quadruple 2-Input Positive-NOR Gate; Published: 8-Jun-2000; LatestRevisionDate: 04-Mar-2005; LatestRevisionNote: Stylized 3D Model Added.; DatasheetVersion: May-1997; PackageVersion: Feb-1999; PackageReference: PW014; Publisher: Altium Limited; PackageDescription: Shrink Small Outline; 14 Leads; Body Width 4.4 mm; Pitch 0.65 mm; ComponentLink1Description: Manufacturer Link; ComponentLink1URL: http://www.ti.com/; ComponentLink2Description: Datasheet; ComponentLink2URL: http://www-s.ti.com/sc/ds/sn74hc02.pdf
U315 = ATxmega64A3-AU: 8/16-bit AVR XMEGA A3 Microcontroller, 1.6-3.6V, 32MHz, 64KB + 4KB Flash, 2KB EEPROM, 4KB SRAM, 64-pin TQFP, Industrial Grade (-40°C to 85°C), Pb-Free; DatasheetVersion: revT, Dec-2010; PackageVersion: revC, Oct-2010; PackageReference: 64A; PackageDescription: 64-Pin Plastic Thin Profile Quad Flat Pack, 14 x 14 x 1.0 mm Body, 0.8 mm Pitch (TQFP); Code_JEDEC: MS-026-AEB; ComponentLink1Description: Manufacturer URL; ComponentLink1URL: http://www.atmel.com/; ComponentLink2Description: ATxmega64A3/128A3/192A3/256A3 Datasheet; ComponentLink2URL: http://www.atmel.com/dyn/resources/prod_documents/doc8068.pdf
U316 U318 = ADM4073: Current Sense Amplifer
U319-U322 = TLC2254CPWR: IC OPAMP QUAD 14-TSSOP
X311 = XTAL: Crystal Oscillator; Published: 8-Jun-2000; LatestRevisionDate: 17-Jul-2002; LatestRevisionNote: Re-released for DXP Platform.; PackageReference: R38; Publisher: Altium Limited; PackageDescription: Crystal, Thru-Hole; 2 Leads; Body 3.1 x 8.2 mm (Dia.xH)

## Sheet POWR0001_BCR_LT1513.SchDoc: BLUEsat Battery Charge Regulator
size A3; Engineer: Thomas Fisk; Organization: BLUEsat Project; Address1: Room 419; Address2: School of EE&T; Address3: UNSW, NSW 2052; Address4: Australia; DocumentNumber: POWR0001; Revision: 2; SheetNumber: 1; SheetTotal: 1; Description: SEPIC battery charge regulator with variable current control; Version: 4; PageSetup: Record=PageOptions|CenterHorizontal=True|CenterVertical=True|PrintScale=0.71|XCorrection=1.00|YCorrection=1.00|PrintKind=1|BorderSize=5000000|LeftOffset=0|BottomOffset=0|Orientation=2|PaperLength=1000|PaperWidth=1000|Scale=100|PaperSource=7|PrintQuality=1200|MediaType=1|DitherType=10|PaperKind=A4|PrintScaleMode=1
Used 5 times, as channels U_POWR0008_BCR_System/X+, U_POWR0008_BCR_System/Y+, U_POWR0008_BCR_System/Z+, U_POWR0008_BCR_System/X-, U_POWR0008_BCR_System/Y-. Parts and nets are listed once, with the designators drawn on the sheet.
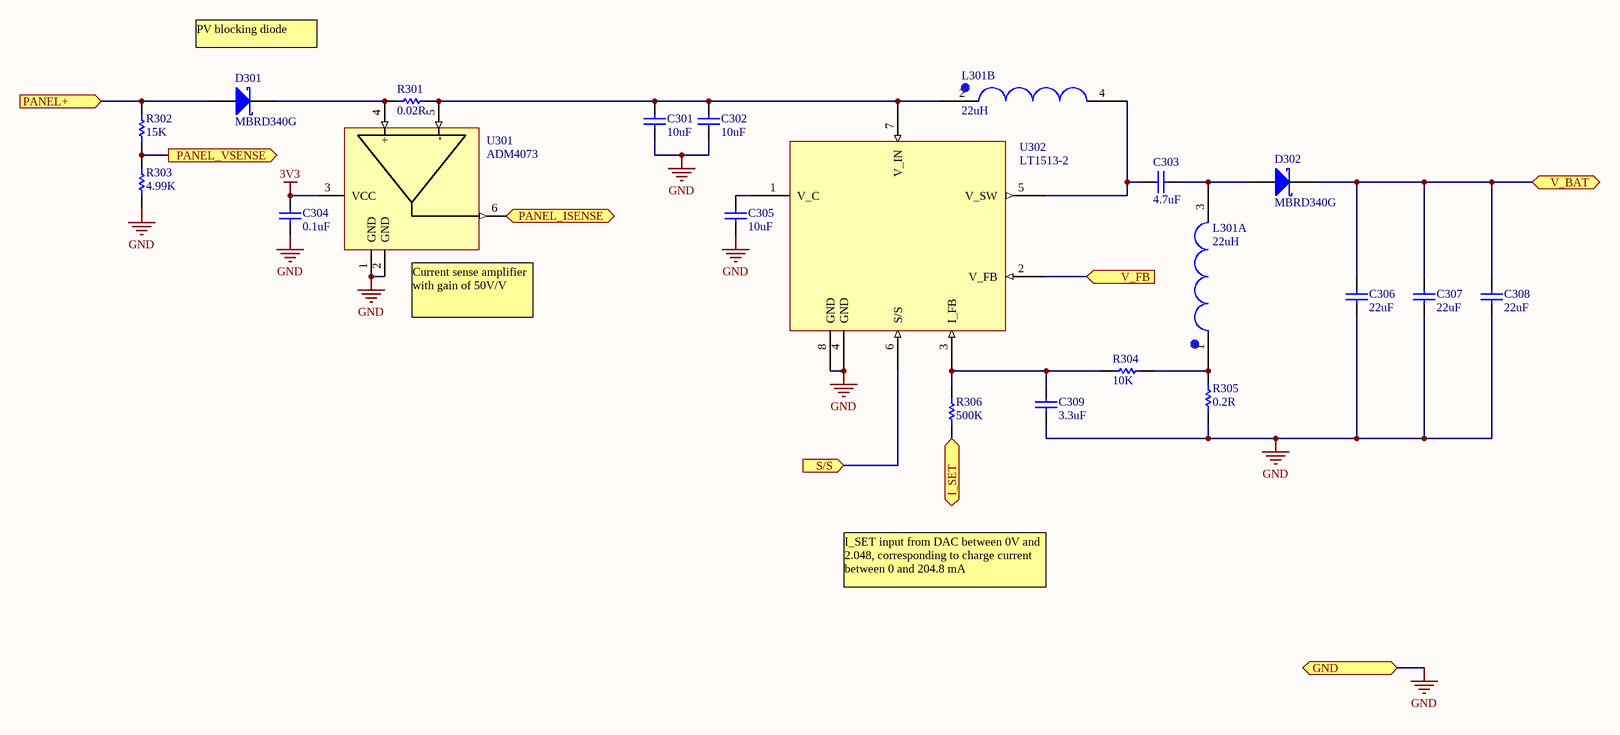
[diagram p2: POWR0001_BCR_LT1513.SchDoc]

### Parts
C301  value 10uF  [CAPC3225M]  (hidden comment: Cap)
C302  value 10uF  [CAPC3225M]  (hidden comment: Cap)
C303  value 4.7uF  [CAPC3225M]  (hidden comment: Cap)
C304  value 0.1uF  [CAPC2012M]  (hidden comment: Cap)
C305  value 10uF  [CAPC3216M]  (hidden comment: Cap)
C306  value 22uF  [CAPC4532M]  (hidden comment: Cap)
C307  value 22uF  [CAPC4532M]  (hidden comment: Cap)
C308  value 22uF  [CAPC4532M]  (hidden comment: Cap)
C309  value 3.3uF  [CAPC3216M]  (hidden comment: Cap)
D301  MBRD340G  [TO229P990X238-3N]
D302  MBRD340G  [TO229P990X238-3N]
L301  value 22uH  [DRQ125]  (hidden comment: DRQ125 Dual Inductor)  (parts A,B of 2)
R301  value 0.02R  [RESC2012M]  (hidden comment: Res1)
R302  value 15K  [RESC2012M]  (hidden comment: Res1)
R303  value 4.99K  [RESC2012M]  (hidden comment: Res1)
R304  value 10K  [RESC2012M]  (hidden comment: Res1)
R305  value 0.2R  [RESC2012M]  (hidden comment: Res1)
R306  value 500K  [RESC2012M]  (hidden comment: Res1)
U301  ADM4073  [SOT26A-6N]
U302  LT1513-2  [LT1513-2_TO127P1420-8N]

### Ports
GND, I_SET (in), PANEL+ (in), PANEL_ISENSE (out), PANEL_VSENSE (out), S/S (in), V_BAT, V_FB (in)

### Nets
3V3: C304.1 U301.3(VCC)
GND: C301.2 C302.2 C304.2 C305.2 C306.2 C307.2 C308.2 C309.1 R303.1 R305.1 U301.1(GND) U301.2(GND) U302.4(GND) U302.8(GND) ; port GND
I_SET: R306.2 ; port I_SET
PANEL+: D301.1(A) R302.2 ; port PANEL+
PANEL_ISENSE: U301.6 ; port PANEL_ISENSE
PANEL_VSENSE: R302.1 R303.2 ; port PANEL_VSENSE
S/S: U302.6(S/S) ; port S/S
V_BAT: C306.1 C307.1 C308.1 D302.2(K) ; port V_BAT
V_FB: U302.2(V_FB) ; port V_FB
NetC301_1: C301.1 C302.1 L301.2 R301.1 U301.5(-) U302.7(V_IN)
NetC303_1: C303.1 D302.1(A) L301.3
NetC303_2: C303.2 L301.4 U302.5(V_SW)
NetC305_1: C305.1 U302.1(V_C)
NetC309_2: C309.2 R304.2 R306.1 U302.3(I_FB)
NetD301_2: D301.2(K) R301.2 U301.4(+)
NetL301_1: L301.1 R304.1 R305.2

### Channels
U_POWR0008_BCR_System/X+: designators C301=C1_X+ C302=C2_X+ C303=C3_X+ C304=C4_X+ C305=C5_X+ C306=C6_X+ C307=C7_X+ C308=C13_Z- C309=C8_X+ D301=D1_X+ D302=D2_X+ L301=L1_X+ R301=R1_X+ R302=R2_X+ R303=R3_X+ R304=R5_X+ R305=R6_X+ R306=R7_X+ U301=U8_X+ U302=U1_X+; ports GND=GND I_SET=I_SET_X+ PANEL+=PANEL_X+ PANEL_ISENSE=ISENSE_X+ PANEL_VSENSE=VSENSE_X+ S/S=NetU1_X+_6 V_BAT=NetC6_X+_1 V_FB=V_FB
U_POWR0008_BCR_System/Y+: designators C301=C1_Y+ C302=C2_Y+ C303=C3_Y+ C304=C4_Y+ C305=C5_Y+ C306=C6_Y+ C307=C7_Y+ C308=C13_Y+ C309=C8_Y+ D301=D1_Y+ D302=D2_Y+ L301=L1_Y+ R301=R1_Y+ R302=R2_Y+ R303=R3_Y+ R304=R5_Y+ R305=R6_Y+ R306=R7_Y+ U301=U8_Y+ U302=U1_Y+; ports GND=GND I_SET=I_SET_Y+ PANEL+=PANEL_Y+ PANEL_ISENSE=ISENSE_Y+ PANEL_VSENSE=VSENSE_Y+ S/S=NetU1_Y+_6 V_BAT=NetC6_X+_1 V_FB=V_FB
U_POWR0008_BCR_System/Z+: designators C301=C1_Z+ C302=C2_Z+ C303=C3_Z+ C304=C4_Z+ C305=C5_Z+ C306=C6_Z+ C307=C7_Z+ C308=C13_Z+ C309=C8_Z+ D301=D1_Z+ D302=D2_Z+ L301=L1_Z+ R301=R1_Z+ R302=R2_Z+ R303=R3_Z+ R304=R5_Z+ R305=R6_Z+ R306=R7_Z+ U301=U8_Z+ U302=U1_Z+; ports GND=GND I_SET=I_SET_Z+ PANEL+=PANEL_Z+ PANEL_ISENSE=ISENSE_Z+ PANEL_VSENSE=VSENSE_Z+ S/S=NetU1_Z+_6 V_BAT=NetC6_X+_1 V_FB=V_FB
U_POWR0008_BCR_System/X-: designators C301=C1_X- C302=C2_X- C303=C3_X- C304=C4_X- C305=C5_X- C306=C6_X- C307=C7_X- C308=C13_X- C309=C8_X- D301=D1_X- D302=D2_X- L301=L1_X- R301=R1_X- R302=R2_X- R303=R3_X- R304=R5_X- R305=R6_X- R306=R7_X- U301=U8_X- U302=U1_X-; ports GND=GND I_SET=I_SET_X- PANEL+=PANEL_X- PANEL_ISENSE=ISENSE_X- PANEL_VSENSE=VSENSE_X- S/S=NetU1_X-_6 V_BAT=NetC6_X+_1 V_FB=V_FB
U_POWR0008_BCR_System/Y-: designators C301=C1_Z- C302=C2_Z- C303=C3_Z- C304=C4_Z- C305=C5_Z- C306=C6_Z- C307=C7_Z- C308=C13_Y- C309=C8_Y- D301=D1_Z- D302=D2_Z- L301=L1_Z- R301=R1_Z- R302=R2_Z- R303=R3_Z- R304=R5_Z- R305=R6_Z- R306=R7_Z- U301=U8_Z- U302=U1_Z-; ports GND=GND I_SET=I_SET_Y- PANEL+=PANEL_Y- PANEL_ISENSE=ISENSE_Y- PANEL_VSENSE=VSENSE_Y- S/S=NetU1_Z-_6 V_BAT=NetC6_X+_1 V_FB=V_FB

### Notes on the sheet
- PV blocking diode
- (near U301) Current sense amplifier with gain of 50V/V
- I_SET input from DAC between 0V and 2.048, corresponding to charge current between 0 and 204.8 mA
- Title
- Description:
- Size:
- Author:
- Date:
- A3
- Time:
- Version
- Sheet:
- Drawing No.:
- of
- File:

### Library data of the parts
C301-C309 = Cap: Capacitor; Published: 8-Jun-2000; LatestRevisionDate: 17-Jul-2002; LatestRevisionNote: Re-released for DXP Platform.; PackageReference: RAD-0.3; Publisher: Altium Limited; PackageDescription: Radial Cap, Thru-Hole; 2 Leads; 0.3 in Pin Spacing; Supplier 1: Farnell; Supplier 2: Farnell
  C301 C302: Supplier Part Number 2: 1844365
  C303: Supplier Part Number 2: 1844381
  C304 C305: Supplier Part Number 2: 1759265
  C306-C308: Supplier Part Number 2: 1844378
  C309: Supplier Part Number 2: 1168132
D301 D302 = Diode 11DQ03: Schottky Rectifier; Published: 8-Jun-2000; LatestRevisionDate: 17-Jul-2002; LatestRevisionNote: Re-released for DXP Platform.; DatasheetVersion: Dec-1997; PackageReference: DO-204AL; Publisher: Altium Limited; PackageDescription: Diode, Axial; Body 5.2 x 2.7 mm (LxDia. max), Lead Dia. 0.86 mm (max); Code_JEDEC: DO-204-AL; ComponentLink1Description: Manufacturer Link; ComponentLink1URL: http://www.irf.com/; ComponentLink2Description: Datasheet; ComponentLink2URL: http://www.irf.com/product-info/datasheets/data/11dq03.pdf; Supplier 1: Farnell; Supplier Part Number 1: 1431096
R301-R306 = Res1: Resistor; Published: 8-Jun-2000; LatestRevisionDate: 17-Jul-2002; LatestRevisionNote: Re-released for DXP Platform.; PackageReference: AXIAL-0.3; Publisher: Altium Limited; PackageDescription: Axial Device, Thru-Hole; 2 Leads; 0.3 in Pin Spacing; Supplier 1: Farnell
U301 = ADM4073: Current Sense Amplifer

## Nets that join several sheets
3V3: POWR0010_BCR_TESTBOARD (6 pins), POWR0008_BCR_System (41 pins)
BAT: POWR0010_BCR_TESTBOARD (BATTERY.1), POWR0008_BCR_System (5 pins)
GND: POWR0010_BCR_TESTBOARD (24 pins), POWR0008_BCR_System (54 pins), U_POWR0008_BCR_System/X+ (14 pins), U_POWR0008_BCR_System/Y+ (14 pins), U_POWR0008_BCR_System/Z+ (14 pins), U_POWR0008_BCR_System/X- (14 pins), U_POWR0008_BCR_System/Y- (14 pins)
LOAD: POWR0010_BCR_TESTBOARD (LOAD.1), POWR0008_BCR_System (R318.1 U318.5)
I_SET_X+: POWR0008_BCR_System (U314.2), U_POWR0008_BCR_System/X+ (R7_X+.2)
I_SET_X-: POWR0008_BCR_System (U314.5), U_POWR0008_BCR_System/X- (R7_X-.2)
I_SET_Y+: POWR0008_BCR_System (U314.3), U_POWR0008_BCR_System/Y+ (R7_Y+.2)
I_SET_Y-: POWR0008_BCR_System (U314.12), U_POWR0008_BCR_System/Y- (R7_Z-.2)
I_SET_Z+: POWR0008_BCR_System (U314.4), U_POWR0008_BCR_System/Z+ (R7_Z+.2)
ISENSE_X+: POWR0008_BCR_System (U319.12), U_POWR0008_BCR_System/X+ (U8_X+.6)
ISENSE_X-: POWR0008_BCR_System (U320.5), U_POWR0008_BCR_System/X- (U8_X-.6)
ISENSE_Y+: POWR0008_BCR_System (U319.5), U_POWR0008_BCR_System/Y+ (U8_Y+.6)
ISENSE_Y-: POWR0008_BCR_System (U321.12), U_POWR0008_BCR_System/Y- (U8_Z-.6)
ISENSE_Z+: POWR0008_BCR_System (U320.12), U_POWR0008_BCR_System/Z+ (U8_Z+.6)
NetC6_X+_1: POWR0008_BCR_System (FB311.1 R313.2), U_POWR0008_BCR_System/X+ (C6_X+.1 C7_X+.1 C13_Z-.1 D2_X+.2), U_POWR0008_BCR_System/Y+ (C6_Y+.1 C7_Y+.1 C13_Y+.1 D2_Y+.2), U_POWR0008_BCR_System/Z+ (C6_Z+.1 C7_Z+.1 C13_Z+.1 D2_Z+.2), U_POWR0008_BCR_System/X- (C6_X-.1 C7_X-.1 C13_X-.1 D2_X-.2), U_POWR0008_BCR_System/Y- (C6_Z-.1 C7_Z-.1 C13_Y-.1 D2_Z-.2)
NetU1_X+_6: POWR0008_BCR_System (U312.1), U_POWR0008_BCR_System/X+ (U1_X+.6)
NetU1_X-_6: POWR0008_BCR_System (U317.1), U_POWR0008_BCR_System/X- (U1_X-.6)
NetU1_Y+_6: POWR0008_BCR_System (U312.4), U_POWR0008_BCR_System/Y+ (U1_Y+.6)
NetU1_Z+_6: POWR0008_BCR_System (U312.10), U_POWR0008_BCR_System/Z+ (U1_Z+.6)
NetU1_Z-_6: POWR0008_BCR_System (U317.4), U_POWR0008_BCR_System/Y- (U1_Z-.6)
PDI_CLK: POWR0010_BCR_TESTBOARD (C328#1.2 FLATSAT.15 R323.2 RESET.2), POWR0008_BCR_System (PDI311.5 U315.57)
V_FB: POWR0008_BCR_System (R313.1 R314.2), U_POWR0008_BCR_System/X+ (U1_X+.2), U_POWR0008_BCR_System/Y+ (U1_Y+.2), U_POWR0008_BCR_System/Z+ (U1_Z+.2), U_POWR0008_BCR_System/X- (U1_X-.2), U_POWR0008_BCR_System/Y- (U1_Z-.2)
VSENSE_X+: POWR0008_BCR_System (U319.10), U_POWR0008_BCR_System/X+ (R2_X+.1 R3_X+.2)
VSENSE_X-: POWR0008_BCR_System (U320.3), U_POWR0008_BCR_System/X- (R2_X-.1 R3_X-.2)
VSENSE_Y+: POWR0008_BCR_System (U319.3), U_POWR0008_BCR_System/Y+ (R2_Y+.1 R3_Y+.2)
VSENSE_Y-: POWR0008_BCR_System (U321.10), U_POWR0008_BCR_System/Y- (R2_Z-.1 R3_Z-.2)
VSENSE_Z+: POWR0008_BCR_System (U320.10), U_POWR0008_BCR_System/Z+ (R2_Z+.1 R3_Z+.2)